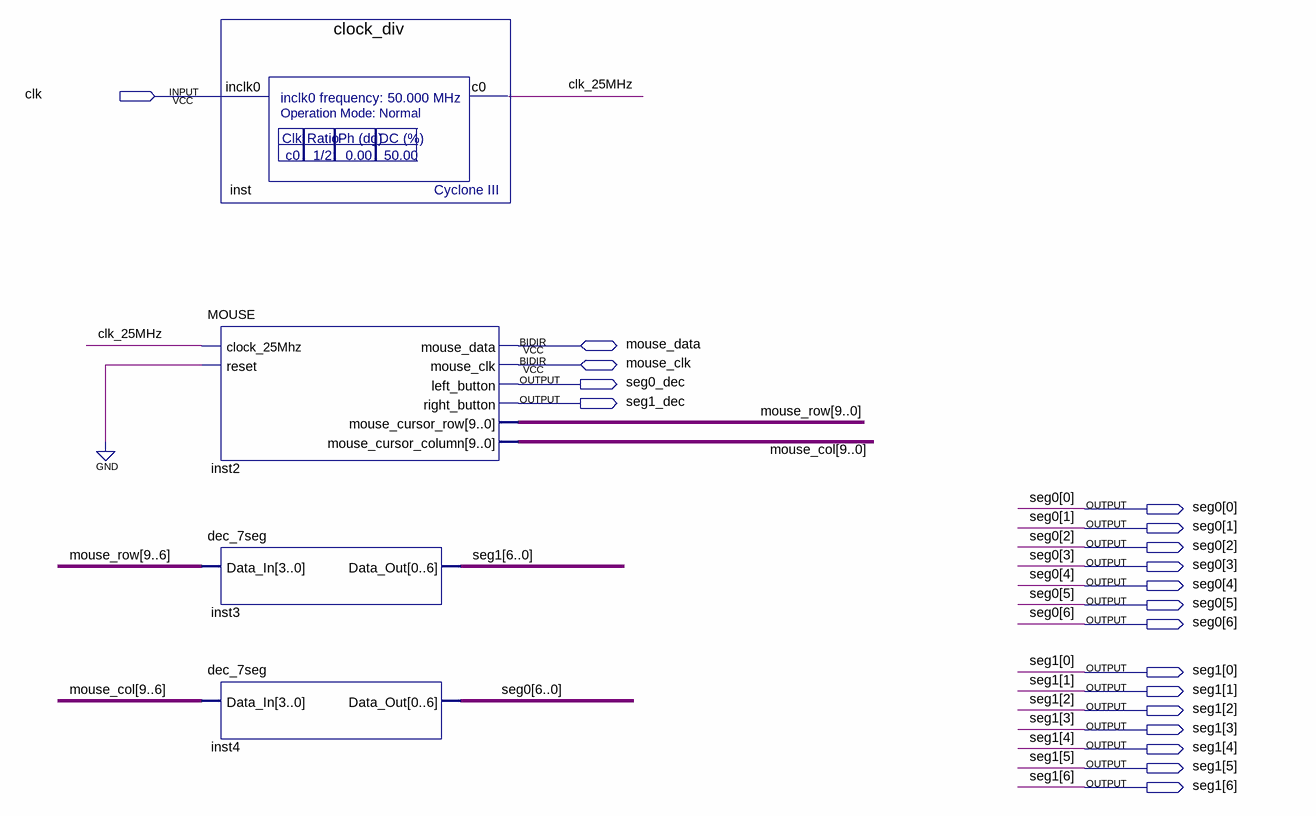
[diagram p0: schematic sheet]
// Quartus schematic mouse_movement.bdf as structural Verilog: 4 symbols, 19 pins
module mouse_movement (
  input  clk,
  inout  mouse_data,
  inout  mouse_clk,
  output seg0_dec,
  output seg1_dec,
  output [6:0] seg0,
  output [6:0] seg1
);

  wire clk_25MHz;
  wire [9:0] mouse_col, mouse_row;

  MOUSE inst2 (
    .clock_25Mhz(clk_25MHz), .reset(1'b0), .left_button(seg0_dec), .right_button(seg1_dec),
    .mouse_cursor_row(mouse_row), .mouse_cursor_column(mouse_col), .mouse_data(mouse_data),
    .mouse_clk(mouse_clk));
  dec_7seg inst3 (.Data_In(mouse_row[9:6]), .Data_Out(seg1));
  dec_7seg inst4 (.Data_In(mouse_col[9:6]), .Data_Out(seg0));
  clock_div inst (.inclk0(clk), .c0(clk_25MHz));
endmodule
